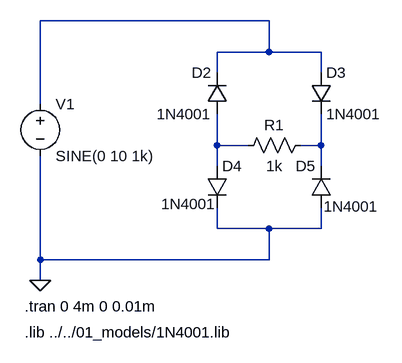
[diagram p0: schematic acdcconv_02_03_01_bridge_vs_vr.asc]
acdcconv_02_03_01_bridge_vs_vr.asc, the LTspice schematic file:
Version 4
SHEET 1 880 680
WIRE 32 0 -320 0
WIRE 32 48 32 0
WIRE 32 48 -48 48
WIRE 112 48 32 48
WIRE -48 80 -48 48
WIRE 112 80 112 48
WIRE -320 128 -320 0
WIRE -48 192 -48 144
WIRE 0 192 -48 192
WIRE 112 192 112 144
WIRE 112 192 80 192
WIRE -48 224 -48 192
WIRE 112 224 112 192
WIRE -48 320 -48 288
WIRE 32 320 -48 320
WIRE 112 320 112 288
WIRE 112 320 32 320
WIRE -320 368 -320 208
WIRE 32 368 32 320
WIRE 32 368 -320 368
WIRE -320 400 -320 368
FLAG -320 400 0
SYMBOL diode -32 144 R180
WINDOW 0 24 64 Left 2
WINDOW 3 24 0 Left 2
SYMATTR InstName D2
SYMATTR Value 1N4001
SYMBOL diode 96 80 R0
SYMATTR InstName D3
SYMATTR Value 1N4001
SYMBOL diode -64 224 R0
WINDOW 3 -70 58 Left 2
SYMATTR InstName D4
SYMATTR Value 1N4001
SYMBOL diode 128 288 R180
WINDOW 0 24 64 Left 2
WINDOW 3 -73 2 Left 2
SYMATTR InstName D5
SYMATTR Value 1N4001
SYMBOL voltage -320 112 R0
WINDOW 123 0 0 Left 2
WINDOW 39 0 0 Left 2
SYMATTR InstName V1
SYMATTR Value SINE(0 10 1k)
SYMBOL res 96 176 R90
WINDOW 0 0 56 VBottom 2
WINDOW 3 32 56 VTop 2
SYMATTR InstName R1
SYMATTR Value 1k
TEXT -344 440 Left 2 !.tran 0 4m 0 0.01m
TEXT -344 480 Left 2 !.lib ../../01_models/1N4001.lib

The netlist it stands for:
* acdcconv_02_03_01_bridge_vs_vr.asc
D2 N002 N001 1N4001
D3 N001 N003 1N4001
D4 N002 0 1N4001
D5 0 N003 1N4001
V1 N001 0 SINE(0 10 1k)
R1 N003 N002 1k
.model D D
.lib standard.dio
.tran 0 4m 0 0.01m
.lib ../../01_models/1N4001.lib
.backanno
.end